# Altium project rovables_expansion.PrjPcb
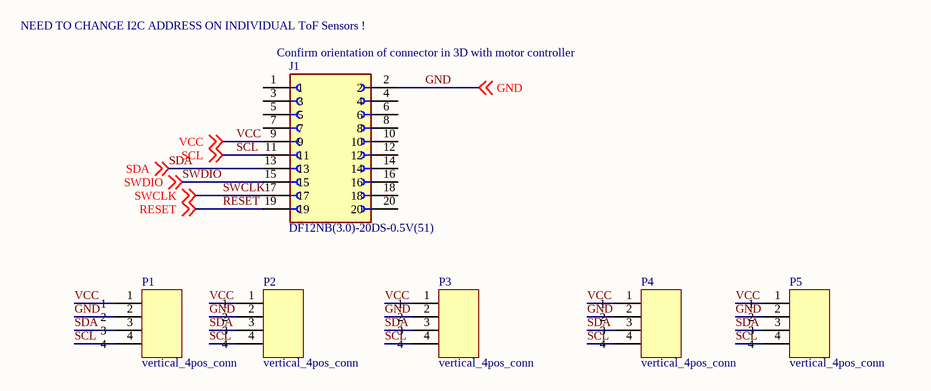
[diagram p0: expansion.SchDoc]
1 sheet, 6 parts. Net scope: global (net labels, ports and power ports of the same name join across sheets).
Board file: expansion.PcbDoc

## Sheet expansion.SchDoc
size A; SheetNumber: 1; SheetTotal: 1

### Parts
J1  DF12NB(3.0)-20DS-0.5V(51)  [HRS_DF12NB(3.0)-20DS-0.5V(51)]
P1  vertical_4pos_conn  [vertical_4pos_conn]
P2  vertical_4pos_conn  [vertical_4pos_conn]
P3  vertical_4pos_conn  [vertical_4pos_conn]
P4  vertical_4pos_conn  [vertical_4pos_conn]
P5  vertical_4pos_conn  [vertical_4pos_conn]

### Nets
GND: J1.2 ; off-sheet GND
RESET: J1.19 ; off-sheet RESET
SCL: J1.11 ; off-sheet SCL
SDA: J1.13 ; off-sheet SDA
SWCLK: J1.17 ; off-sheet SWCLK
SWDIO: J1.15 ; off-sheet SWDIO
VCC: J1.9 ; off-sheet VCC

Not connected (* = marked no-connect by the designer): J1 1 3 4 5 6 7 8 10 12 14 16 18 20; P1 1 2 3 4; P2 1 2 3 4; P3 1 2 3 4; P4 1 2 3 4; P5 1 2 3 4

### Notes on the sheet
- NEED TO CHANGE I2C ADDRESS ON INDIVIDUAL ToF Sensors !
- (near J1) Confirm orientation of connector in 3D with motor controller

### Library data of the parts
J1 = DF12NB(3.0)-20DS-0.5V(51): Value: *; Availability: Unavailable; Package: None; Price: None; MP: DF12NB(3.0)-20DS-0.5V(51)